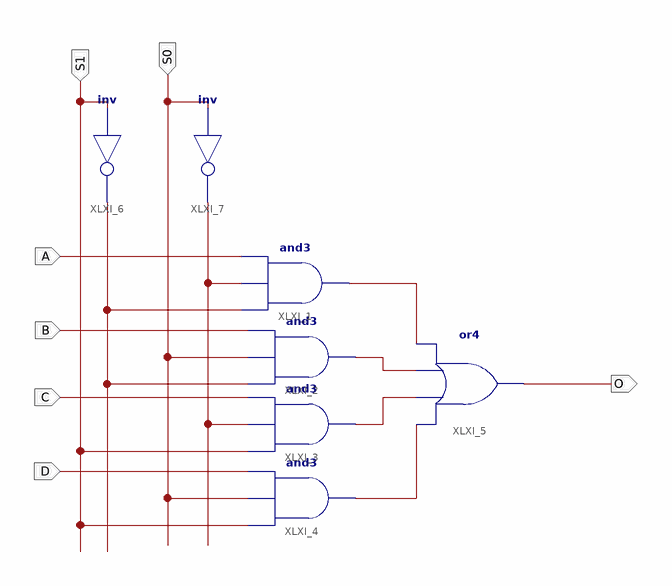
[diagram p0: schematic sheet 1]
// Xilinx ISE schematic sixteenbitaddersubtractor.sch (artix7) as structural Verilog: 7 symbols, 7 ports
module sixteenbitaddersubtractor (
  input  S0,
  input  S1,
  input  D,
  input  C,
  input  B,
  input  A,
  output O
);

  wire XLXN_1, XLXN_2, XLXN_15, XLXN_16, XLXN_17, XLXN_18;

  and XLXI_1 (XLXN_15, XLXN_1, XLXN_2, A);
  and XLXI_2 (XLXN_16, XLXN_1, S0, B);
  and XLXI_3 (XLXN_17, S1, XLXN_2, C);
  and XLXI_4 (XLXN_18, S1, S0, D);
  or XLXI_5 (O, XLXN_18, XLXN_17, XLXN_16, XLXN_15);
  not XLXI_6 (XLXN_1, S1);
  not XLXI_7 (XLXN_2, S0);
endmodule
